# Altium project LPEDT.PrjPcb (part 3 of 3)

## Sheet EFR32BG13_IO_Port_Pins.SchDoc
size A4; SheetNumber: 6; SheetTotal: 8
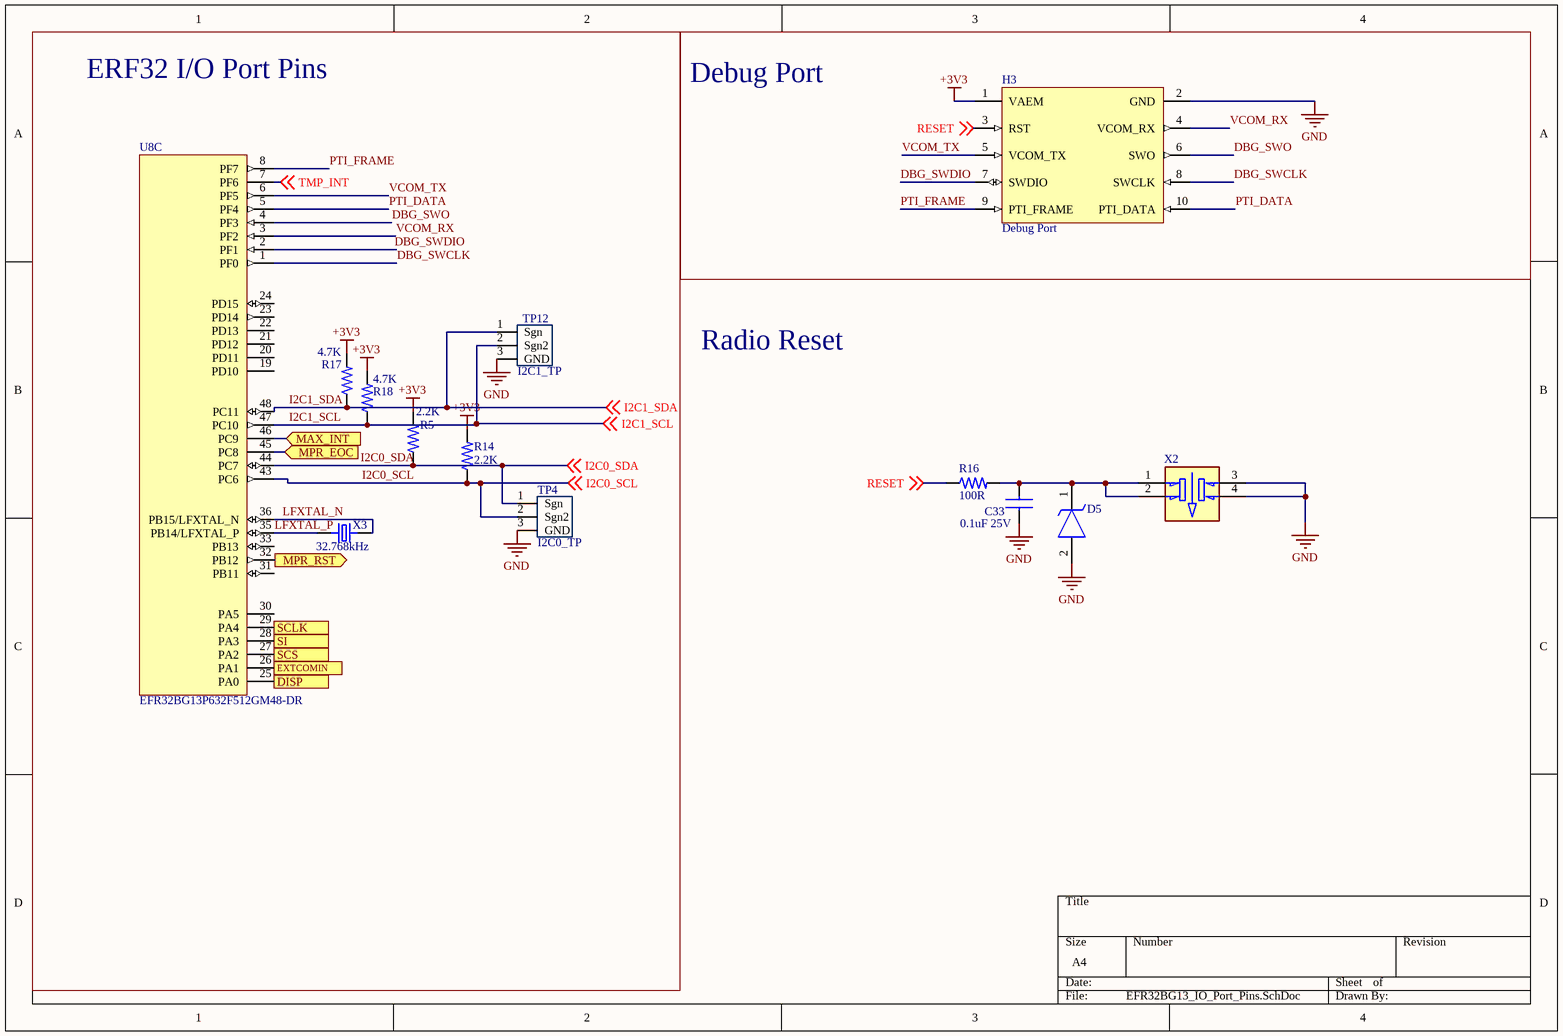
[diagram p5: EFR32BG13_IO_Port_Pins.SchDoc]

### Parts
C33  0.1uF 25V  [Chip2Pin_1.6x0.8x0.9_CAP]
D5  TVS DIODE 5.5VWM 12VC SOD923  [SODFL1006X40N]  (value not drawn)
H3  Debug Port  [Amphenol_20021121_0]
R5  2.2K  [RES_0603_1608X06]
R14  2.2K  [RES_0603_1608X06]
R16  100R  [RES_0603_1608X06]
R17  4.7K  [RES_0603_1608X06]
R18  4.7K  [RES_0603_1608X06]
TP4  I2C0_TP  [TP10x_Floating_3PIN]
TP12  I2C1_TP  [TP10x_Floating_3PIN]
U8  EFR32BG13P632F512GM48-DR  [QFN_48_7X7]  (part C of 3)
X2  SWITCH TACTILE SPST-NO 0.05A 42V  [1241160111]  (value not drawn)
X3  32.768kHz  [XTAL_ECS-.327-7-34B-TR]

### Blocks framed on the sheet
ERF32 I/O Port Pins: R5 R14 R17 R18 TP4 TP12 U8 X3
Debug Port: H3

### Ports
DISP (out, see LCD_Connector[1B]), EXTCOMIN (out, see LCD_Connector[2B]), MAX_INT (in, see MAX30101[3B]), MPR_EOC (in, see MPR[3C]), MPR_RST (out, see MPR[3C]), SCLK (out, see LCD_Connector[2B]), SCS (out, see LCD_Connector[2B]), SI (out, see LCD_Connector[2B])

### Nets
+3V3: H3.1(VAEM) R5.2 R14.2 R17.2 R18.2
GND: C33.2 D5.2(A) H3.2(GND) TP4.3(GND) TP12.3(GND) X2.3(NC2) X2.4(COM2)
DBG_SWCLK: H3.8(SWCLK) U8.1(PF0)
DBG_SWDIO: H3.7(SWDIO) U8.2(PF1)
DBG_SWO: H3.6(SWO) U8.4(PF3)
DISP: U8.25(PA0) ; port DISP
EXTCOMIN: U8.26(PA1) ; port EXTCOMIN
I2C0_SCL: R14.1 TP4.2(Sgn2) U8.43(PC6) ; off-sheet I2C0_SCL
I2C0_SDA: R5.1 TP4.1(Sgn) U8.44(PC7) ; off-sheet I2C0_SDA
I2C1_SCL: R18.1 TP12.2(Sgn2) U8.47(PC10) ; off-sheet I2C1_SCL
I2C1_SDA: R17.1 TP12.1(Sgn) U8.48(PC11) ; off-sheet I2C1_SDA
LFXTAL_N: U8.36(PB15/LFXTAL_N) X3.2
LFXTAL_P: U8.35(PB14/LFXTAL_P) X3.1
MAX_INT: U8.46(PC9) ; port MAX_INT
MPR_EOC: U8.45(PC8) ; port MPR_EOC
MPR_RST: U8.32(PB12) ; port MPR_RST
PTI_DATA: H3.10(PTI_DATA) U8.5(PF4)
PTI_FRAME: H3.9(PTI_FRAME) U8.8(PF7)
RESET: H3.3(RST) R16.1 ; off-sheet RESET
SCLK: U8.29(PA4) ; port SCLK
SCS: U8.27(PA2) ; port SCS
SI: U8.28(PA3) ; port SI
TMP_INT: U8.7(PF6) ; off-sheet TMP_INT
VCOM_RX: H3.4(VCOM_RX) U8.3(PF2)
VCOM_TX: H3.5(VCOM_TX) U8.6(PF5)
NetC33_1: C33.1 D5.1(K) R16.2 X2.1(NC1) X2.2(COM1)

Not connected (* = marked no-connect by the designer): U8 19(PD10) 20(PD11) 21(PD12) 22(PD13) 23(PD14) 24(PD15) 30(PA5) 31(PB11) 33(PB13)

### Notes on the sheet
- Radio Reset

### Library data of the parts
C33 = GCJ188R71E104KA12D: Cap Ceramic 0.1uF 25V X7R 10% Pad SMD 0603 Soft Termination 125C Automotive T/R; Manufacturer: Murata; Value: 100nF; Supplier 1: Arrow Electronics; Manufacturer Part Number: GCJ188R71E104KA12D; RoHS: Yes; Category: Ceramic Capacitors; Stock 1: 11360; Pricing 1: 1=0.14710, 10=0.11710, 25=0.11140, 100=0.11030, 250=0.10920, 500=0.10810, 1000=0.10700, 3000=0.10600, 6000=0.10490 (USD); Mounting Technology: Surface Mount; Case/Package: 0603; Case Code (Imperial): 0603; Case Code (Metric): 1608; Min Operating Temperature: -55°C; Max Operating Temperature: 125°C; Features: Soft Termination; Packaging: Tape and Reel; Tolerance: 10%; Voltage Rating: 25V; Ratings: AEC-Q200; RoHS Compliant: Yes; ComponentLink1URL: http://search.murata.co.jp/Ceramy/image/img/A01X/G101/ENG/GCJ188R71E104KA12-01.pdf?src-supplier=Digi-Key; ComponentLink1Description: http://search.murata.co.jp/Ceramy/image/img/A01X/G101/ENG/GCJ188R71E104KA12-01.pdf?src-supplier=Digi-Key
D5 = D5V0M1U2S9-7: ESD Suppressors / TVS Diodes Bi-Directional 35pF Dataline Protection; Number of Unidirectional Channels: 1; Reverse Standoff Voltage: 5.5V; Min Breakdown Voltage: 6.2V; Clamping Voltage: 12V; Peak Pulse Power: 108W; Power Line Protection: No; Peak Pulse Current: 9A; Supplier 1: Arrow Electronics; Manufacturer: Diodes; Manufacturer Part Number: D5V0M1U2S9-7; RoHS: Yes; Category: TVS Diodes; Stock 1: 75890; Pricing 1: 1=0.24290, 10=0.18040, 100=0.10220, 500=0.06670, 1000=0.04280, 2000=0.03710, 5000=0.03470, 10000=0.02760, 30000=0.02740, 50000=0.02710, 100000=0.02240 (USD); Mounting Technology: Surface Mount; Min Operating Temperature: -65°C; Max Operating Temperature: 150°C; Packaging: Tape and Reel; Resistor Type: Zener; RoHS Compliant: Yes; ComponentLink1URL: http://www.mouser.com/ds/2/115/D5V0M1U2S9-756882.pdf?src-supplier=Mouser; ComponentLink1Description: http://www.mouser.com/ds/2/115/D5V0M1U2S9-756882.pdf?src-supplier=Mouser; ComponentLink2URL: https://www.diodes.com/assets/Datasheets/D5V0M1U2S9.pdf?src-supplier=Digi-Key; ComponentLink2Description: https://www.diodes.com/assets/Datasheets/D5V0M1U2S9.pdf?src-supplier=Digi-Key
H3 = 20021121-00010C1LF: CONN HEADER SMD 10POS 1.27MM. Connector Header Surface Mount 10 position 0.050"; Manufacturer: Amphenol ICC / FCI; Supplier 1: Digi-Key; Manufacturer Part Number: 20021121-00010C1LF; RoHS: No; Category: Headers and Wire Housings
R5 R14 = RC0603FR-072K2L: Res Thick Film 0603 2.2K Ohm 1% 0.1W(1/10W) ±100ppm/°C Pad SMD T/R; Manufacturer: Yageo; Value: 2.2kR; Power Rating: 100mW; Voltage Rating: 50V; Supplier 1: Future Electronics; Manufacturer Part Number: RC0603FR-072K2L; RoHS: Yes; Category: Chip SMD Resistors; Stock 1: 1981; Pricing 1: 1=0.10000, 20=0.06610, 100=0.04800, 500=0.02980, 2500=0.01160 (USD); Case/Package: 0603; Case Code (Imperial): 0603; Case Code (Metric): 1608; Min Operating Temperature: -55°C; Max Operating Temperature: 155°C; Tolerance: 1%; Packaging: Tape and Reel; Package Quantity: 1; Termination: SMD/SMT; Resistor Type: Thick Film; Number of Terminations: 2; Temperature Coefficient: 100ppm/°C; Max Power Dissipation: 100mW; Features: Moisture Resistant; Series: RC; Resistance Tolerance: 1%; Construction: Rectangular; Length: 1.6mm; Width: 0.031inch; Height: 0.022inch; Depth: 0.8mm; Lead Free: Lead Free; RoHS Compliant: Yes; Military Standard: Not; ComponentLink1URL: https://datasheet.ciiva.com/2453/pyu-r-int-thick-7-2453943.pdf?src-supplier=Digi-Key; ComponentLink1Description: https://datasheet.ciiva.com/2453/pyu-r-int-thick-7-2453943.pdf?src-supplier=Digi-Key; ComponentLink2URL: https://datasheet.ciiva.com/2453/pyu-r-int-thick-7-2453944.pdf?src-supplier=Digi-Key; ComponentLink2Description: https://datasheet.ciiva.com/2453/pyu-r-int-thick-7-2453944.pdf?src-supplier=Digi-Key; ComponentLink3URL: https://datasheet.ciiva.com/2453/pyu-r-int-thick-7-2453945.pdf?src-supplier=Digi-Key; ComponentLink3Description: https://datasheet.ciiva.com/2453/pyu-r-int-thick-7-2453945.pdf?src-supplier=Digi-Key; ComponentLink4URL: https://datasheet.ciiva.com/7660/1868787-7660791.pdf?src-supplier=Element14; ComponentLink4Description: https://datasheet.ciiva.com/7660/1868787-7660791.pdf?src-supplier=Element14; ComponentLink5URL: https://datasheet.ciiva.com/46394/443971-46394958.pdf?src-supplier=Element14; ComponentLink5Description: https://datasheet.ciiva.com/46394/443971-46394958.pdf?src-supplier=Element14; ComponentLink6URL: https://datasheet.ciiva.com/46440/1868787-46440902.pdf?src-supplier=Element14; ComponentLink6Description: https://datasheet.ciiva.com/46440/1868787-46440902.pdf?src-supplier=Element14
R16 = RC0603JR-07100RL: Res Thick Film 0603 100 Ohm 5% 1/10W ±100ppm/°C Molded SMD SMD Paper T/R; Manufacturer: Yageo; Power Rating: 100mW; Voltage Rating: 50V; Supplier 1: Future Electronics; Manufacturer Part Number: RC0603JR-07100RL; RoHS: Yes; Category: Chip SMD Resistors; Stock 1: 19949; Pricing 1: 1=0.10000, 20=0.06700, 100=0.04930, 500=0.03160, 2500=0.01390 (USD); Case/Package: 0603; Pins: 2; Case Code (Imperial): 0603; Case Code (Metric): 1608; Contact Plating: Tin,Matte; Min Operating Temperature: -55°C; Max Operating Temperature: 155°C; Value: 100R; Tolerance: 5%; Packaging: Tape and Reel; Voltage Rating (DC): 50V; Termination: SMD/SMT; Temperature Coefficient: 100ppm/°C; Resistor Type: Thick Film; Features: Moisture Resistant; Series: RC; Max Power Dissipation: 100mW; Number of Terminations: 2; Construction: Rectangular; Resistance Tolerance: 5%; Length: 1.6mm; Width: 0.8mm; Depth: 0.8mm; Radiation Hardening: No; Military Standard: Not; Lead Free: Lead Free; RoHS Compliant: Yes; ComponentLink1URL: http://www.farnell.com/datasheets/2167052.pdf?src-supplier=Farnell; ComponentLink1Description: http://www.farnell.com/datasheets/2167052.pdf?src-supplier=Farnell; ComponentLink2URL: http://www.mouser.com/ds/2/447/RC0603-272842.pdf?src-supplier=Mouser; ComponentLink2Description: http://www.mouser.com/ds/2/447/RC0603-272842.pdf?src-supplier=Mouser; ComponentLink3URL: http://www.farnell.com/datasheets/2167052.pdf?src-supplier=Newark; ComponentLink3Description: http://www.farnell.com/datasheets/2167052.pdf?src-supplier=Newark; ComponentLink4URL: http://www.farnell.com/datasheets/2167052.pdf?src-supplier=Element14; ComponentLink4Description: http://www.farnell.com/datasheets/2167052.pdf?src-supplier=Element14; ComponentLink5URL: http://www.yageo.com/documents/recent/PYu-RC_Group_51_RoHS_L_10.pdf?src-supplier=Digi-Key; ComponentLink5Description: http://www.yageo.com/documents/recent/PYu-RC_Group_51_RoHS_L_10.pdf?src-supplier=Digi-Key; ComponentLink6URL: http://www.yageo.com/documents/recent/PYu-RC_Group_51_RoHS_L_9.pdf?src-supplier=Digi-Key; ComponentLink6Description: http://www.yageo.com/documents/recent/PYu-RC_Group_51_RoHS_L_9.pdf?src-supplier=Digi-Key
R17 R18 = RC0603JR-074K7L: Res General Purpose Thick Film 0603 4.7k Ohm 5% 1/10W ±100ppm/°C Molded Paper T/R; Manufacturer: Yageo; Voltage Rating (DC): 50V; Value: 4.7kR; Power Rating: 100mW; Supplier 1: Future Electronics; Manufacturer Part Number: RC0603JR-074K7L; RoHS: Yes; Category: Chip SMD Resistors; Stock 1: 36770000; Pricing 1: 5000=0.00120, 75000=0.00110, 200000=0.00110, 750000=0.00100, 2000000=0.00100 (USD); Case/Package: 0603; Pins: 2; Case Code (Imperial): 0603; Case Code (Metric): 1608; Min Operating Temperature: -55°C; Max Operating Temperature: 155°C; Tolerance: 5%; Voltage Rating: 50V; Packaging: Tape and Reel; Termination: SMD/SMT; Resistor Type: Thick Film; Temperature Coefficient: 100ppm/°C; Features: Moisture Resistant; Max Power Dissipation: 100mW; Number of Terminations: 2; Series: RC; Resistance Tolerance: 5%; Construction: Rectangular; Length: 1.6mm; Width: 0.8mm; Depth: 0.8mm; Reach SVHC Compliant: Yes; Military Standard: Not; Lead Free: Lead Free; RoHS Compliant: Yes; ComponentLink1URL: https://datasheet.ciiva.com/46412/443971-46412858.pdf?src-supplier=Element14; ComponentLink1Description: https://datasheet.ciiva.com/46412/443971-46412858.pdf?src-supplier=Element14
TP4 TP12 = 10X_FLOAT_3PIN_TP
U8 = EFR32BG13P632F512GM48-DR: Blue Gecko BLE Soc QFN48 2.4 G 10 dB BLE/Proprietary 512 kB 64 kB(RAM) 31GPIO; Manufacturer: Silicon Labs; Supplier 1: Digi-Key; Manufacturer Part Number: EFR32BG13P632F512GM48-DR; Category: RF Receivers, Transceivers; Stock 1: 17440; Pricing 1: 1=7.81000, 10=7.16300, 25=6.51200, 100=5.86080, 250=5.37240, 500=4.88400, 1000=4.44000 (USD); ComponentLink1URL: https://datasheet.octopart.com/EFR32BG13P632F512GM48-DR-Silicon-Labs-datasheet-150822224.pdf?src-supplier=Silicon+Labs; ComponentLink1Description: https://datasheet.octopart.com/EFR32BG13P632F512GM48-DR-Silicon-Labs-datasheet-150822224.pdf?src-supplier=Silicon+Labs; ComponentLink2URL: https://datasheet.octopart.com/EFR32BG13P632F512GM48-DR-Silicon-Labs-datasheet-142345357.pdf?src-supplier=Silicon+Labs+SCT; ComponentLink2Description: https://datasheet.octopart.com/EFR32BG13P632F512GM48-DR-Silicon-Labs-datasheet-142345357.pdf?src-supplier=Silicon+Labs+SCT; ComponentLink3URL: https://datasheet.octopart.com/EFR32BG13P632F512GM48-DR-Silicon-Labs-datasheet-150822225.pdf?src-supplier=Farnell; ComponentLink3Description: https://datasheet.octopart.com/EFR32BG13P632F512GM48-DR-Silicon-Labs-datasheet-150822225.pdf?src-supplier=Farnell; Supplier Part Number 1: 336-EFR32BG13P632F512GM48-DRCT-ND
X2 = 1241.1601.11: Switch Tactile N.O. SPST Round Button J-Lead 0.05A 30VAC 42VDC 0.12VA >1000000Cycles 1.6N SMD Box; Manufacturer: Schurter; Actuator Material: Polyphenylene; Operating Force: 180gf; Max Current Rating: 50mA; Voltage Rating (AC): 30V; Illumination Type: Non-Illuminated,Illuminated; Switch Travel: 0.35mm; Switch Function: Off-Mom; Actuator Type: Standard; Actuator Length: 1.3mm; Ratings: IP40; Supplier 1: Rs; Manufacturer Part Number: 1241.1601.11; RoHS: Yes; Category: Tactile Switches; Stock 1: 104; Pricing 1: 1=3.18000, 10=3.01000, 25=2.82000 (GBP); Mounting Technology: Surface Mount; Case/Package: SMD/SMT; Contact Material: Gold; Weight: 0.024692oz; Mechanical Life: 1000000Cycles; Min Operating Temperature: -40°C; Max Operating Temperature: 85°C; Package Quantity: 100; Packaging: Bulk; Throw Configuration: SPST; Voltage Rating (DC): 42V; Contact Current Rating: 50mA; Current Rating: 50mA; Max Voltage Rating (DC): 42V; Max Voltage Rating (AC): 30V; Termination: J-Lead; Orientation: Straight; Series: SMS; Length: 11.4mm; Depth: 11.8mm; Reach SVHC Compliant: Yes; RoHS Compliant: Yes; ComponentLink1URL: https://datasheet.ciiva.com/25603/0900766b81148c24-25603899.pdf?src-supplier=Rs; ComponentLink1Description: https://datasheet.ciiva.com/25603/0900766b81148c24-25603899.pdf?src-supplier=Rs
X3 = ECS-.327-7-34B-TR: 32.768kHz Â±20ppm Crystal 7pF 70 kOhms 2-SMD, No Lead; MF: ECS Inc.; Availability: Unavailable; MP: ECS-.327-7-34B-TR; Price: None; Value: *; SnapEDA_Link: https://www.snapeda.com/parts/ECS-.327-7-34B-TR/ECS%20Inc./view-part/55054/?ref=snap; Package: SMD-2 ECS International

## Sheet LCD_Connector.SchDoc
size A4; SheetNumber: 7; SheetTotal: 8
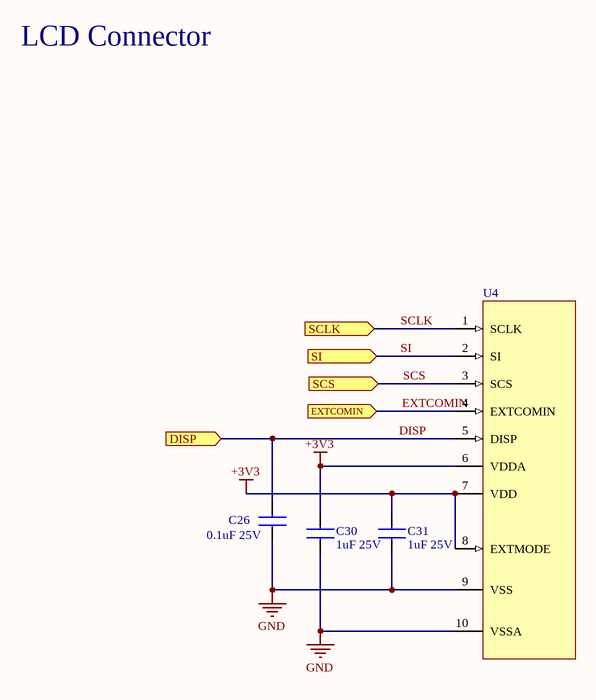
[diagram p6: LCD_Connector.SchDoc]

### Parts
C26  0.1uF 25V  [Chip2Pin_1.6x0.8x0.9_CAP]
C30  1uF 25V  [Chip2Pin_1.6x0.8x0.9_CAP]
C31  1uF 25V  [Chip2Pin_1.6x0.8x0.9_CAP]
U4  10 Position FFC, FPC Connector Contacts, Top and Bottom 0.020" (0.50mm) Surface Mount, Right Angle  [FFC_10POS_0.5MM_PITCH]  (value not drawn)

### Ports
DISP (in, see EFR32BG13_IO_Port_Pins[1C]), EXTCOMIN (in, see EFR32BG13_IO_Port_Pins[1C]), SCLK (in, see EFR32BG13_IO_Port_Pins[1C]), SCS (in, see EFR32BG13_IO_Port_Pins[1C]), SI (in, see EFR32BG13_IO_Port_Pins[1C])

### Nets
+3V3: C30.1 C31.1 U4.6(VDDA) U4.7(VDD) U4.8(EXTMODE)
GND: C26.2 C30.2 C31.2 U4.9(VSS) U4.10(VSSA)
DISP: C26.1 U4.5(DISP) ; port DISP
EXTCOMIN: U4.4(EXTCOMIN) ; port EXTCOMIN
SCLK: U4.1(SCLK) ; port SCLK
SCS: U4.3(SCS) ; port SCS
SI: U4.2(SI) ; port SI

### Notes on the sheet
- LCD Connector

### Library data of the parts
C26 = GCJ188R71E104KA12D: as C33 on sheet EFR32BG13_IO_Port_Pins; Supplier 1: Arrow Electronics; Manufacturer Part Number: GCJ188R71E104KA12D; RoHS: Yes; Category: Ceramic Capacitors; Stock 1: 11360; Pricing 1: 1=0.14710, 10=0.11710, 25=0.11140, 100=0.11030, 250=0.10920, 500=0.10810, 1000=0.10700, 3000=0.10600, 6000=0.10490 (USD); Mounting Technology: Surface Mount; Case/Package: 0603; Case Code (Imperial): 0603; Case Code (Metric): 1608; Min Operating Temperature: -55°C; Max Operating Temperature: 125°C; Features: Soft Termination; Packaging: Tape and Reel; Tolerance: 10%; Voltage Rating: 25V; Ratings: AEC-Q200; RoHS Compliant: Yes; ComponentLink1URL: http://search.murata.co.jp/Ceramy/image/img/A01X/G101/ENG/GCJ188R71E104KA12-01.pdf?src-supplier=Digi-Key; ComponentLink1Description: http://search.murata.co.jp/Ceramy/image/img/A01X/G101/ENG/GCJ188R71E104KA12-01.pdf?src-supplier=Digi-Key
C30 C31 = GCM188R71E105KA64J: Cap Ceramic 1uF 25V X7R 10% Pad SMD 0603 125C Automotive T/R; Manufacturer: Murata; Supplier 1: Arrow Electronics; Manufacturer Part Number: GCM188R71E105KA64J; RoHS: Yes; Category: Ceramic Capacitors; Stock 1: 30000; Pricing 1: 10000=0.03520, 20000=0.03290, 30000=0.03110, 50000=0.03040, 100000=0.02490, 250000=0.02380 (USD); Mounting Technology: Surface Mount; Case/Package: 0603; Case Code (Imperial): 0603; Case Code (Metric): 1608; Weight: 0.000222oz; Min Operating Temperature: -55°C; Max Operating Temperature: 125°C; Value: 1uF; Tolerance: 10%; Dielectric: X7R; Packaging: Tape and Reel; Voltage Rating: 25V; Termination: SMD/SMT; Voltage Rating (DC): 25V; Package Quantity: 10000; Length: 1.6mm; Width: 0.8mm; Height: 0.8mm; Thickness: 0.035inch; Depth: 0.8mm; Ratings: AEC-Q200; Radiation Hardening: No; RoHS Compliant: Yes; ComponentLink1URL: http://www.mouser.com/ds/2/281/c03e-806517.pdf?src-supplier=Mouser; ComponentLink1Description: http://www.mouser.com/ds/2/281/c03e-806517.pdf?src-supplier=Mouser; ComponentLink2URL: http://www.murata.com/~/media/webrenewal/support/library/catalog/products/capacitor/mlcc/c03e.ashx?src-supplier=Digi-Key; ComponentLink2Description: http://www.murata.com/~/media/webrenewal/support/library/catalog/products/capacitor/mlcc/c03e.ashx?src-supplier=Digi-Key
U4 = AYF531035: CONN FFC FPC 10POS 0.50MM R/A; Manufacturer: Panasonic; Actuator Material: Polymer,Liquid Crystal Polymer; Contact Resistance: 80mR; Max Voltage Rating (DC): 5.05kV; Current Rating: 500mA; Voltage Rating: 50V; Number of Positions: 10; Contact Location: Dual; Pitch: 0.5mm; Supplier 1: Avnet; Manufacturer Part Number: AYF531035; RoHS: Yes; Category: FFC / FPC; Stock 1: 5000; Pricing 1: 5000=0.86580, 5100=0.85100, 11000=0.83620, 25000=0.82140, 50000=0.80660 (USD); Mounting Technology: Surface Mount; Contact Material: Copper Alloy; Contact Plating: Gold; Housing Material: Polymer; Min Operating Temperature: -55°C; Max Operating Temperature: 85°C; Number of Rows: 1; Package Quantity: 1000; Packaging: Tape and Reel; Termination: Solder; Number of Contacts: 10; Orientation: Right Angle; Series: Y5B; Radiation Hardening: No; Lead Free: Lead Free; Flammability Rating: UL94 V-0; RoHS Compliant: Yes; ComponentLink1URL: http://www.mouser.com/ds/2/315/Panasonic_Y5B_Y5BW%20Series-1076217.pdf?src-supplier=Mouser; ComponentLink1Description: http://www.mouser.com/ds/2/315/Panasonic_Y5B_Y5BW%20Series-1076217.pdf?src-supplier=Mouser; ComponentLink2URL: http://www.onlinecomponents.com/datasheet/ayf531035.aspx?p=41877477&src-supplier=Onlinecomponents.com; ComponentLink2Description: http://www.onlinecomponents.com/datasheet/ayf531035.aspx?p=41877477&src-supplier=Onlinecomponents.com; ComponentLink3URL: http://www.panasonic-electric-works.com/catalogues/downloads/connectors/ds_65315_en_y5b_y5bw.pdf?src-supplier=Avnet; ComponentLink3Description: http://www.panasonic-electric-works.com/catalogues/downloads/connectors/ds_65315_en_y5b_y5bw.pdf?src-supplier=Avnet; ComponentLink4URL: https://www3.panasonic.biz/ac/e_download/control/connector/fpc-ffc/catalog/con_eng_y5bw.pdf?src-supplier=Digi-Key; ComponentLink4Description: https://www3.panasonic.biz/ac/e_download/control/connector/fpc-ffc/catalog/con_eng_y5bw.pdf?src-supplier=Digi-Key

## Sheet High-Level Block Diagram.SchDoc: High Level Block Diagram
size A4; DocumentNumber: 1; SheetNumber: 8; SheetTotal: 8
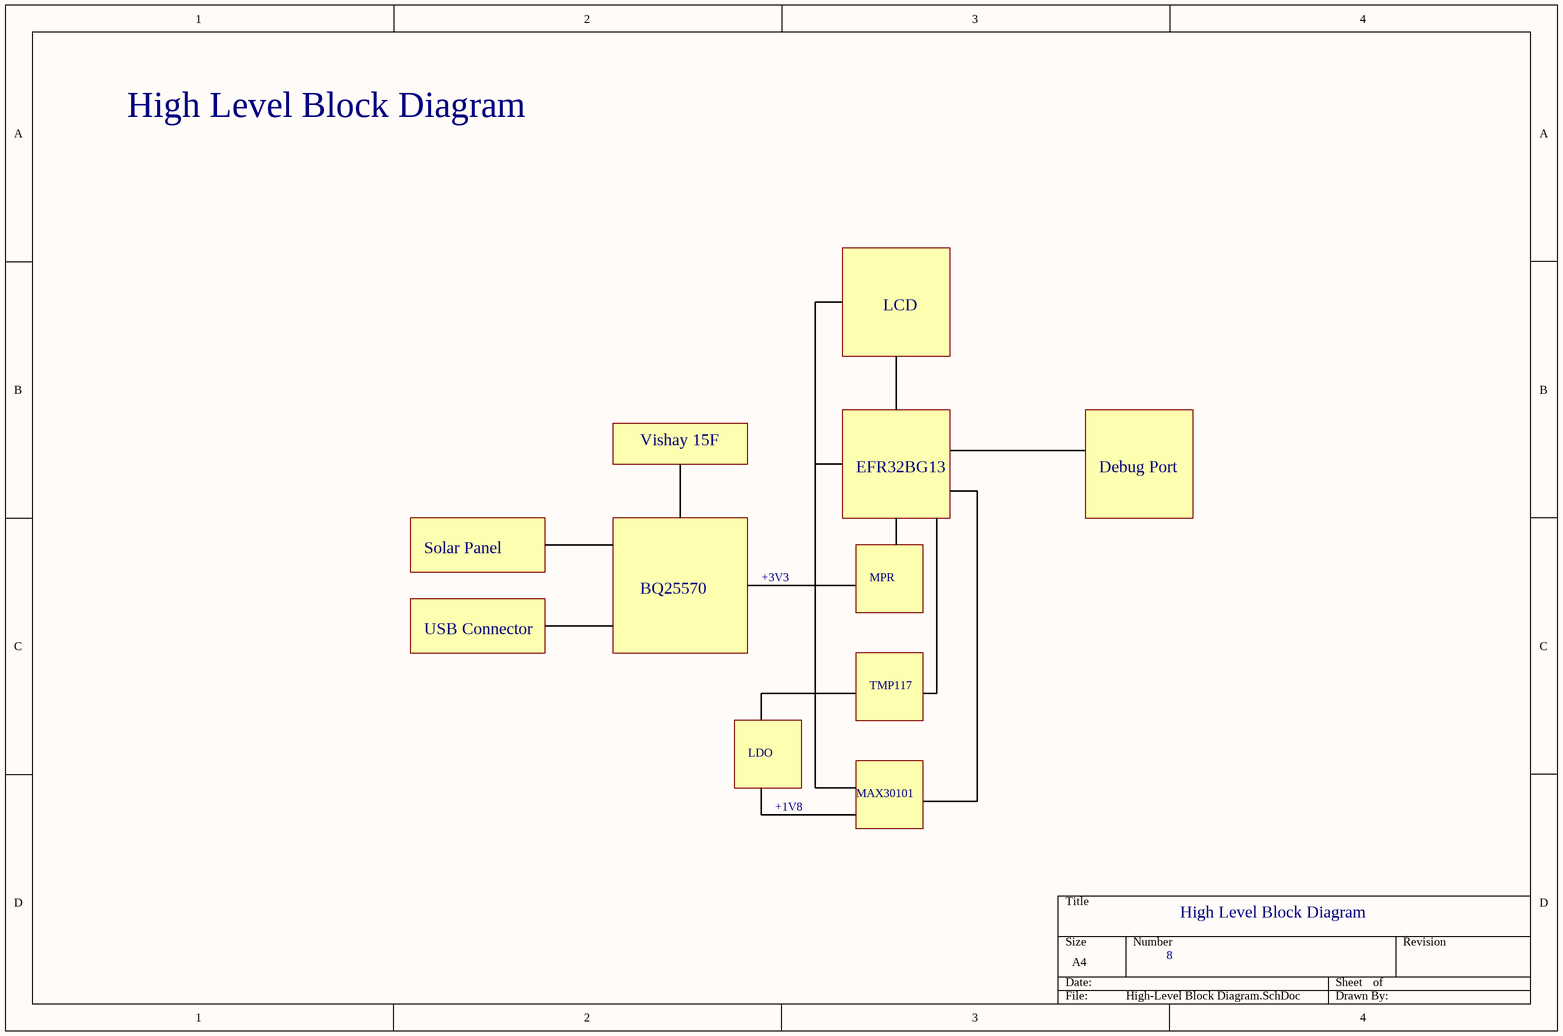
[diagram p7: High-Level Block Diagram.SchDoc]

### Notes on the sheet
- High Level Block Diagram
- LCD
- Vishay 15F
- EFR32BG13
- Debug Port
- Solar Panel
- +3V3
- MPR
- USB Connector
- BQ25570
- TMP117
- LDO
- +1V8
- MAX30101

## Nets that join several sheets
+1V8: MAX30101 (C4.1 C5.1 U3.11), BQ25570 (C29.1 TP10.1 U6.5)
+3V3: TMP117 (C1.1 R1.2 U1.5), MPR (C3.1 R2.2 U2.12), MAX30101 (5 pins), EFR32BG13_EF_Antenna_Power (7 pins), BQ25570 (5 pins), EFR32BG13_IO_Port_Pins (5 pins), LCD_Connector (5 pins)
GND: TMP117 (C1.2 U1.2 U1.4 U1.7), MPR (C3.2 U2.10), MAX30101 (6 pins), EFR32BG13_EF_Antenna_Power (21 pins), BQ25570 (37 pins), EFR32BG13_IO_Port_Pins (7 pins), LCD_Connector (5 pins)
DISP: EFR32BG13_IO_Port_Pins (U8.25), LCD_Connector (C26.1 U4.5)
EXTCOMIN: EFR32BG13_IO_Port_Pins (U8.26), LCD_Connector (U4.4)
I2C0_SCL: TMP117 (U1.1), MPR (U2.3), EFR32BG13_IO_Port_Pins (R14.1 TP4.2 U8.43)
I2C0_SDA: TMP117 (U1.6), MPR (U2.2), EFR32BG13_IO_Port_Pins (R5.1 TP4.1 U8.44)
I2C1_SCL: MAX30101 (U3.3), EFR32BG13_IO_Port_Pins (R18.1 TP12.2 U8.47)
I2C1_SDA: MAX30101 (U3.2), EFR32BG13_IO_Port_Pins (R17.1 TP12.1 U8.48)
MAX_INT: MAX30101 (R3.1 U3.13), EFR32BG13_IO_Port_Pins (U8.46)
MPR_EOC: MPR (U2.8), EFR32BG13_IO_Port_Pins (U8.45)
MPR_RST: MPR (R2.1 U2.9), EFR32BG13_IO_Port_Pins (U8.32)
RESET: EFR32BG13_EF_Antenna_Power (R24.1 U8.12), EFR32BG13_IO_Port_Pins (H3.3 R16.1)
SCLK: EFR32BG13_IO_Port_Pins (U8.29), LCD_Connector (U4.1)
SCS: EFR32BG13_IO_Port_Pins (U8.27), LCD_Connector (U4.3)
SI: EFR32BG13_IO_Port_Pins (U8.28), LCD_Connector (U4.2)
TMP_INT: TMP117 (R1.1 U1.3), EFR32BG13_IO_Port_Pins (U8.7)